# EAGLE design Rev A (EAGLE 6.5.0)

## Sheet 1 of 3: Pre-Amp
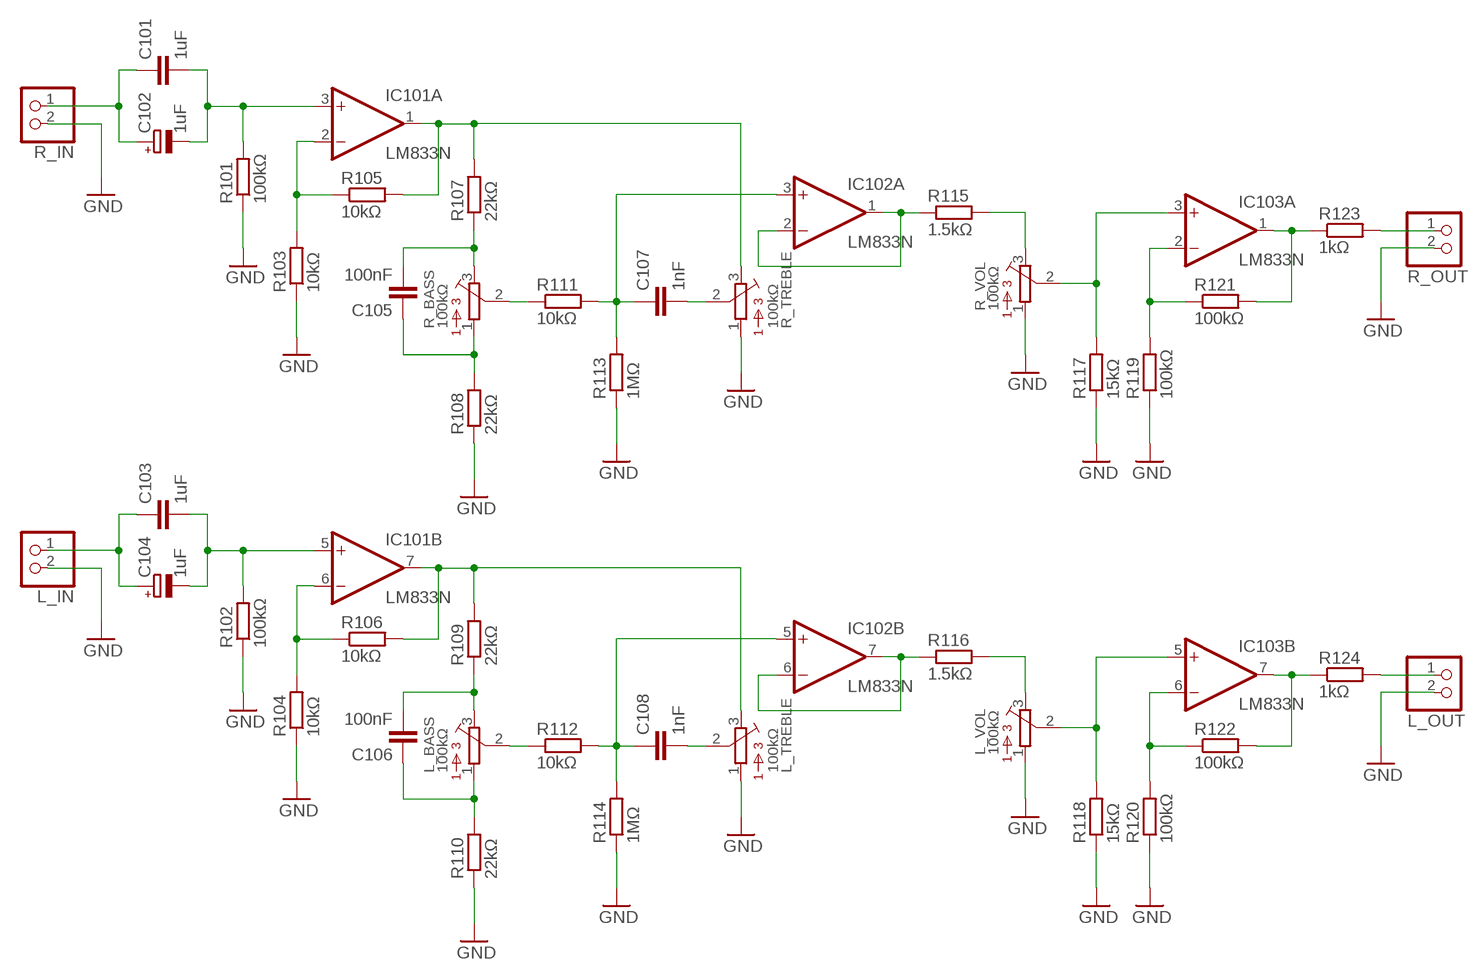
[diagram p0: schematic, sheet 1]

### Parts
C101  1uF  C-EU150-072X183  [C150-072X183]
C102  1uF  CPOL-EUE2-5  [E2-5]
C103  1uF  C-EU150-072X183  [C150-072X183]
C104  1uF  CPOL-EUE2-5  [E2-5]
C105  100nF  C-EU050-025X075  [C050-025X075]
C106  100nF  C-EU050-025X075  [C050-025X075]
C107  1nF  C-EU050-025X075  [C050-025X075]
C108  1nF  C-EU050-025X075  [C050-025X075]
IC101  LM833N  [DIL08]
IC102  LM833N  [DIL08]
IC103  LM833N  [DIL08]
L_BASS  100kΩ  3362U  [3362U]
L_IN  JST_2PIN-THM  [JST-PH-2-THM]
L_OUT  JST_2PIN-THM  [JST-PH-2-THM]
L_TREBLE  100kΩ  3362U  [3362U]
L_VOL  100kΩ  3362U  [3362U]
R101  100kΩ  R-EU_0207/10  [0207/10]
R102  100kΩ  R-EU_0207/10  [0207/10]
R103  10kΩ  R-EU_0207/10  [0207/10]
R104  10kΩ  R-EU_0207/10  [0207/10]
R105  10kΩ  R-EU_0207/10  [0207/10]
R106  10kΩ  R-EU_0207/10  [0207/10]
R107  22kΩ  R-EU_0207/10  [0207/10]
R108  22kΩ  R-EU_0207/10  [0207/10]
R109  22kΩ  R-EU_0207/10  [0207/10]
R110  22kΩ  R-EU_0207/10  [0207/10]
R111  10kΩ  R-EU_0207/10  [0207/10]
R112  10kΩ  R-EU_0207/10  [0207/10]
R113  1MΩ  R-EU_0207/10  [0207/10]
R114  1MΩ  R-EU_0207/10  [0207/10]
R115  1.5kΩ  R-EU_0207/10  [0207/10]
R116  1.5kΩ  R-EU_0207/10  [0207/10]
R117  15kΩ  R-EU_0207/10  [0207/10]
R118  15kΩ  R-EU_0207/10  [0207/10]
R119  100kΩ  R-EU_0207/10  [0207/10]
R120  100kΩ  R-EU_0207/10  [0207/10]
R121  100kΩ  R-EU_0207/10  [0207/10]
R122  100kΩ  R-EU_0207/10  [0207/10]
R123  1kΩ  R-EU_0207/10  [0207/10]
R124  1kΩ  R-EU_0207/10  [0207/10]
R_BASS  100kΩ  3362U  [3362U]
R_IN  JST_2PIN-THM  [JST-PH-2-THM]
R_OUT  JST_2PIN-THM  [JST-PH-2-THM]
R_TREBLE  100kΩ  3362U  [3362U]
R_VOL  100kΩ  3362U  [3362U]

### Nets
GND: L_IN.2 L_OUT.2 L_TREBLE.1 L_VOL.1 R101.1 R102.1 R103.1 R104.1 R108.1 R110.1 R113.1 R114.1 R117.1 R118.1 R119.1 R120.1 R_IN.2 R_OUT.2 R_TREBLE.1 R_VOL.1 ; also sheet 2,3
N$1: L_OUT.1 R124.2
N$2: R123.2 R_OUT.1
N$4: C101.2 C102.- IC101.3(A:+IN) R101.2
N$7: C103.2 C104.- IC101.5(B:+IN) R102.2
N$8: C101.1 C102.+ R_IN.1
N$22: C103.1 C104.+ L_IN.1
N$56: IC102.1(A:OUT) IC102.2(A:-IN) R115.1
N$57: C105.2 R107.1 R_BASS.3
N$58: IC103.3(A:+IN) R117.2 R_VOL.2
N$59: IC101.2(A:-IN) R103.2 R105.1
N$60: R115.2 R_VOL.3
N$61: C105.1 R108.2 R_BASS.1
N$62: IC103.2(A:-IN) R119.2 R121.1
N$63: IC103.1(A:OUT) R121.2 R123.1
N$64: R111.1 R_BASS.2
N$65: C107.1 IC102.3(A:+IN) R111.2 R113.2
N$66: C107.2 R_TREBLE.2
N$67: IC102.6(B:-IN) IC102.7(B:OUT) R116.1
N$68: IC101.6(B:-IN) R104.2 R106.1
N$69: IC101.1(A:OUT) R105.2 R107.2 R_TREBLE.3
N$70: IC103.5(B:+IN) L_VOL.2 R118.2
N$71: L_VOL.3 R116.2
N$72: C106.2 L_BASS.3 R109.1
N$73: C106.1 L_BASS.1 R110.2
N$74: L_BASS.2 R112.1
N$75: C108.1 IC102.5(B:+IN) R112.2 R114.2
N$76: C108.2 L_TREBLE.2
N$77: IC101.7(B:OUT) L_TREBLE.3 R106.2 R109.2
N$78: IC103.6(B:-IN) R120.2 R122.1
N$79: IC103.7(B:OUT) R122.2 R124.1

## Sheet 2 of 3: Power Supply
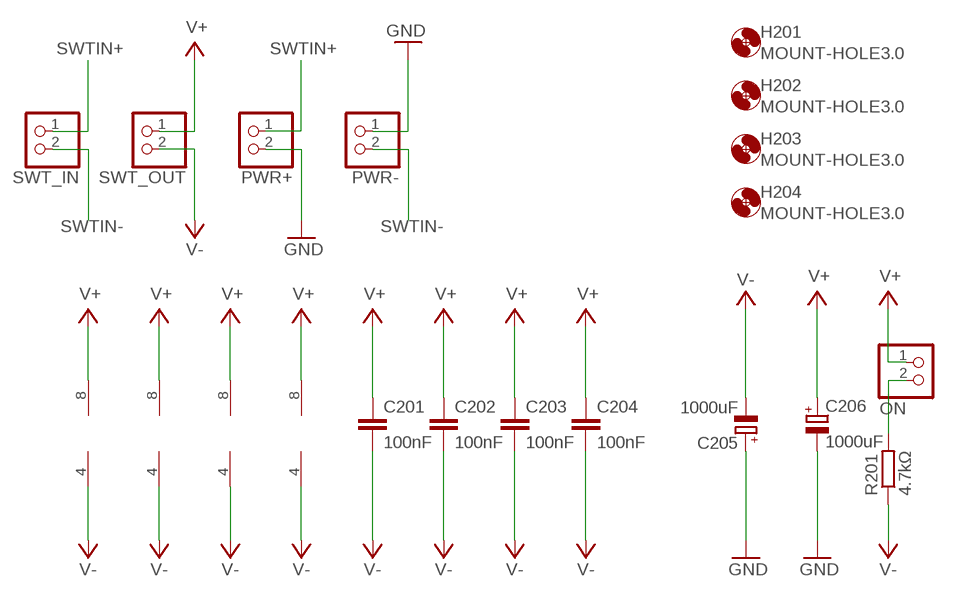
[diagram p1: schematic, sheet 2]

### Parts
C201  100nF  C-EU025-025X050  [C025-025X050]
C202  100nF  C-EU025-025X050  [C025-025X050]
C203  100nF  C-EU025-025X050  [C025-025X050]
C204  100nF  C-EU025-025X050  [C025-025X050]
C205  1000uF  CPOL-EUE5-10.5  [E5-10,5]
C206  1000uF  CPOL-EUE5-10.5  [E5-10,5]
H201  MOUNT-HOLE3.0  [3,0]
H202  MOUNT-HOLE3.0  [3,0]
H203  MOUNT-HOLE3.0  [3,0]
H204  MOUNT-HOLE3.0  [3,0]
IC201  LM393N  [DIL08]
ON  JST_2PIN-THM  [JST-PH-2-THM]
PWR+  JST_2PIN-THM  [JST-PH-2-THM]
PWR-  JST_2PIN-THM  [JST-PH-2-THM]
R201  4.7kΩ  R-EU_0207/10  [0207/10]
SWT_IN  JST_2PIN-THM  [JST-PH-2-THM]
SWT_OUT  JST_2PIN-THM  [JST-PH-2-THM]

### Nets
GND: C205.+ C206.- PWR+.2 PWR-.1 ; also sheet 1,3
N$55: ON.2 R201.2
SWTIN+: PWR+.1 SWT_IN.1
SWTIN-: PWR-.2 SWT_IN.2
V+: C201.1 C202.1 C203.1 C204.1 C206.+ IC101.8(P:V+) IC102.8(P:V+) IC103.8(P:V+) IC201.8(P:V+) ON.1 SWT_OUT.1 ; also sheet 3
V-: C201.2 C202.2 C203.2 C204.2 C205.- IC101.4(P:V-) IC102.4(P:V-) IC103.4(P:V-) IC201.4(P:V-) R201.1 SWT_OUT.2 ; also sheet 3

## Sheet 3 of 3: Low Voltage Detector
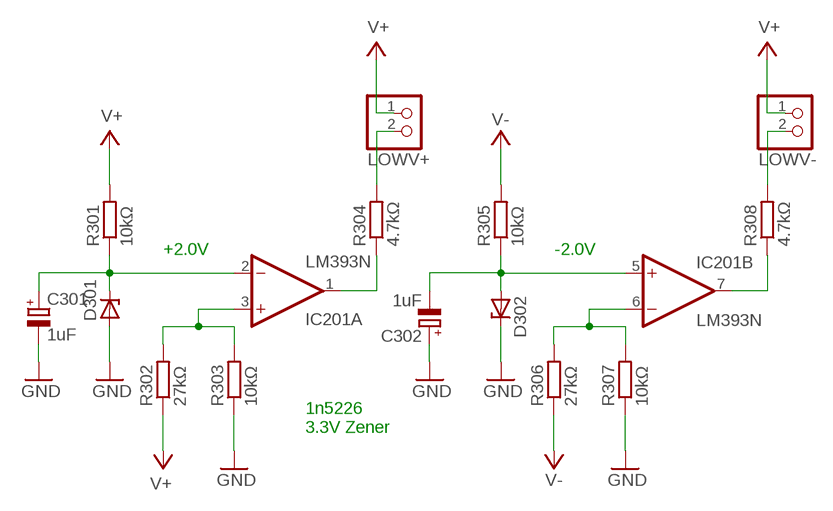
[diagram p2: schematic, sheet 3]

### Parts
C301  1uF  CPOL-EUE2-5  [E2-5]
C302  1uF  CPOL-EUE2-5  [E2-5]
D301  BZV10  [DO34Z7]
D302  BZV10  [DO34Z7]
LOWV+  JST_2PIN-THM  [JST-PH-2-THM]
LOWV-  JST_2PIN-THM  [JST-PH-2-THM]
R301  10kΩ  R-EU_0207/10  [0207/10]
R302  27kΩ  R-EU_0207/10  [0207/10]
R303  10kΩ  R-EU_0207/10  [0207/10]
R304  4.7kΩ  R-EU_0207/10  [0207/10]
R305  10kΩ  R-EU_0207/10  [0207/10]
R306  27kΩ  R-EU_0207/10  [0207/10]
R307  10kΩ  R-EU_0207/10  [0207/10]
R308  4.7kΩ  R-EU_0207/10  [0207/10]

### Nets
GND: C301.- C302.+ D301.A D302.C R303.1 R307.1 ; also sheet 1,2
N$3: C301.+ D301.C IC201.2(A:-IN) R301.1
N$5: C302.- D302.A IC201.5(B:+IN) R305.1
N$6: LOWV+.2 R304.2
N$9: IC201.3(A:+IN) R302.2 R303.2
N$10: IC201.6(B:-IN) R306.2 R307.2
N$11: IC201.1(A:OUT) R304.1
N$12: LOWV-.2 R308.2
N$13: IC201.7(B:OUT) R308.1
V+: LOWV+.1 LOWV-.1 R301.2 R302.1 ; also sheet 2
V-: R305.2 R306.1 ; also sheet 2

### Notes on the sheet
- +2.0V | -2.0V
- 1n5226
  3.3V Zener

## Library data of the parts
C101 C103 C105-C108 C201-C204 = rcl:C-EU: CAPACITOR, European symbol
C102 C104 C205 C206 C301 C302 = rcl:CPOL-EU: POLARIZED CAPACITOR, European symbol
D301 D302 = diode:BZV10: Z DIODE
H201-H204 = holes:MOUNT-HOLE: MOUNTING HOLE with drill center marker
IC101-IC103 = linear:LM833: OP AMP
IC201 = linear:LM393: COMPARATOR
L_BASS L_TREBLE L_VOL R_BASS R_TREBLE R_VOL = bourns:3362: 3362 Series 1/4" Square Trimmer
L_IN L_OUT LOWV+ LOWV- ON PWR+ PWR- R_IN R_OUT SWT_IN SWT_OUT = adafruit:JST_2PIN: JST 2-Pin Connectors of various flavors SMT-RA (S2B-PH-SM4) 4UConnector #17311 SMT (B2B-PH-SM4) THM-RA (S2B-PH) THM (B2B-PH)
R101-R124 R201 R301-R308 = rcl:R-EU_: RESISTOR, European symbol

## Board
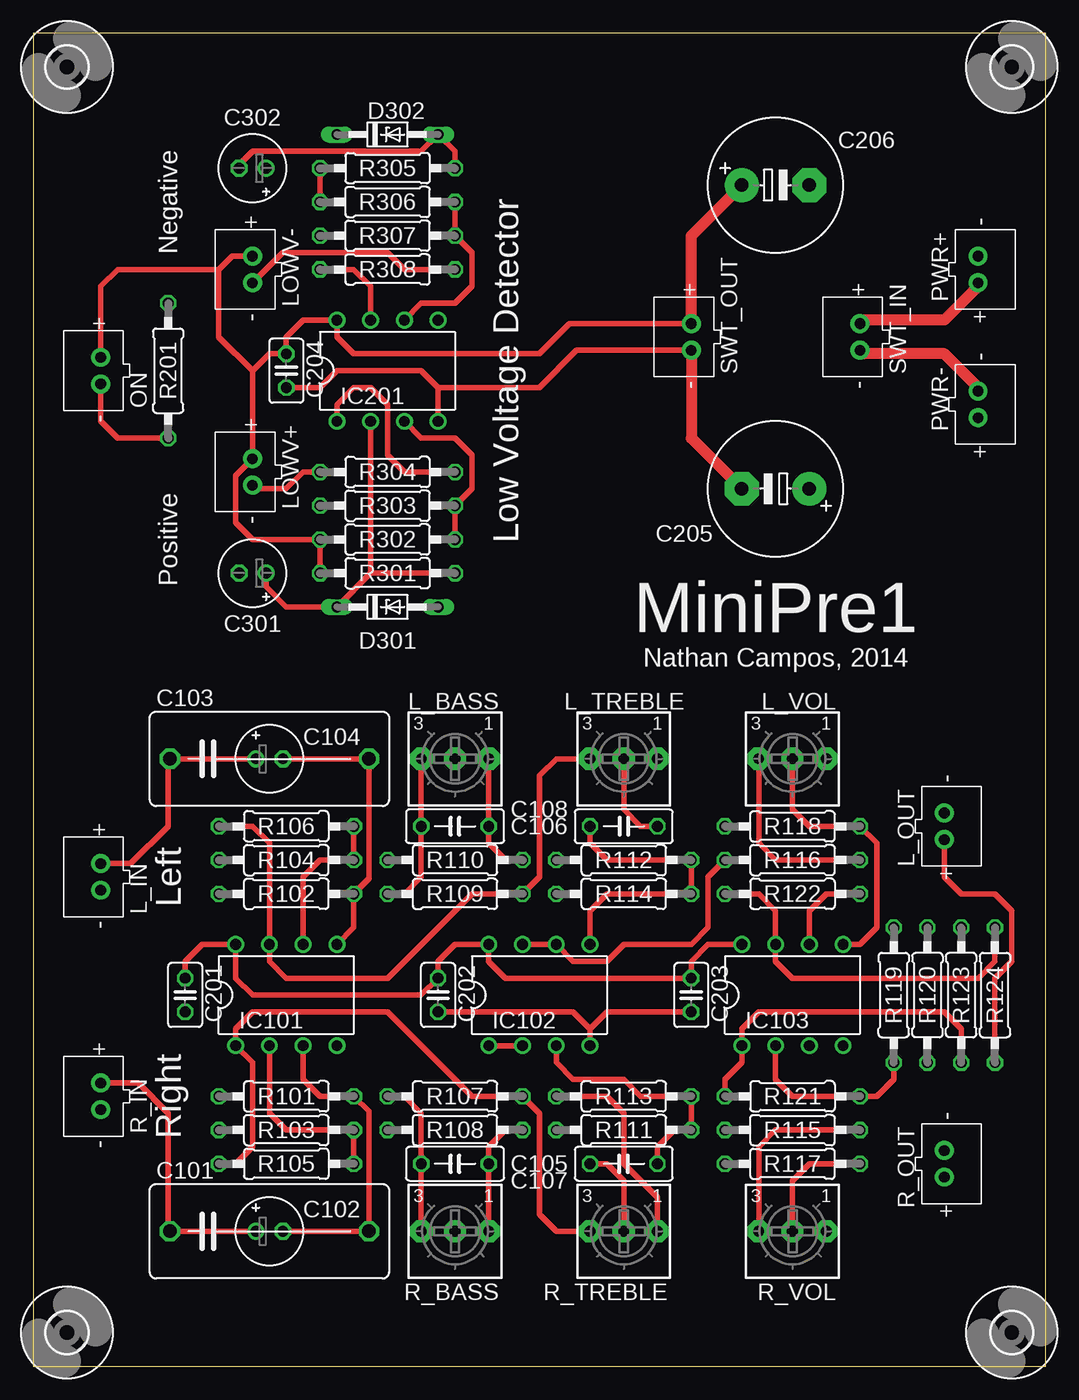
[diagram p3: board, top side]
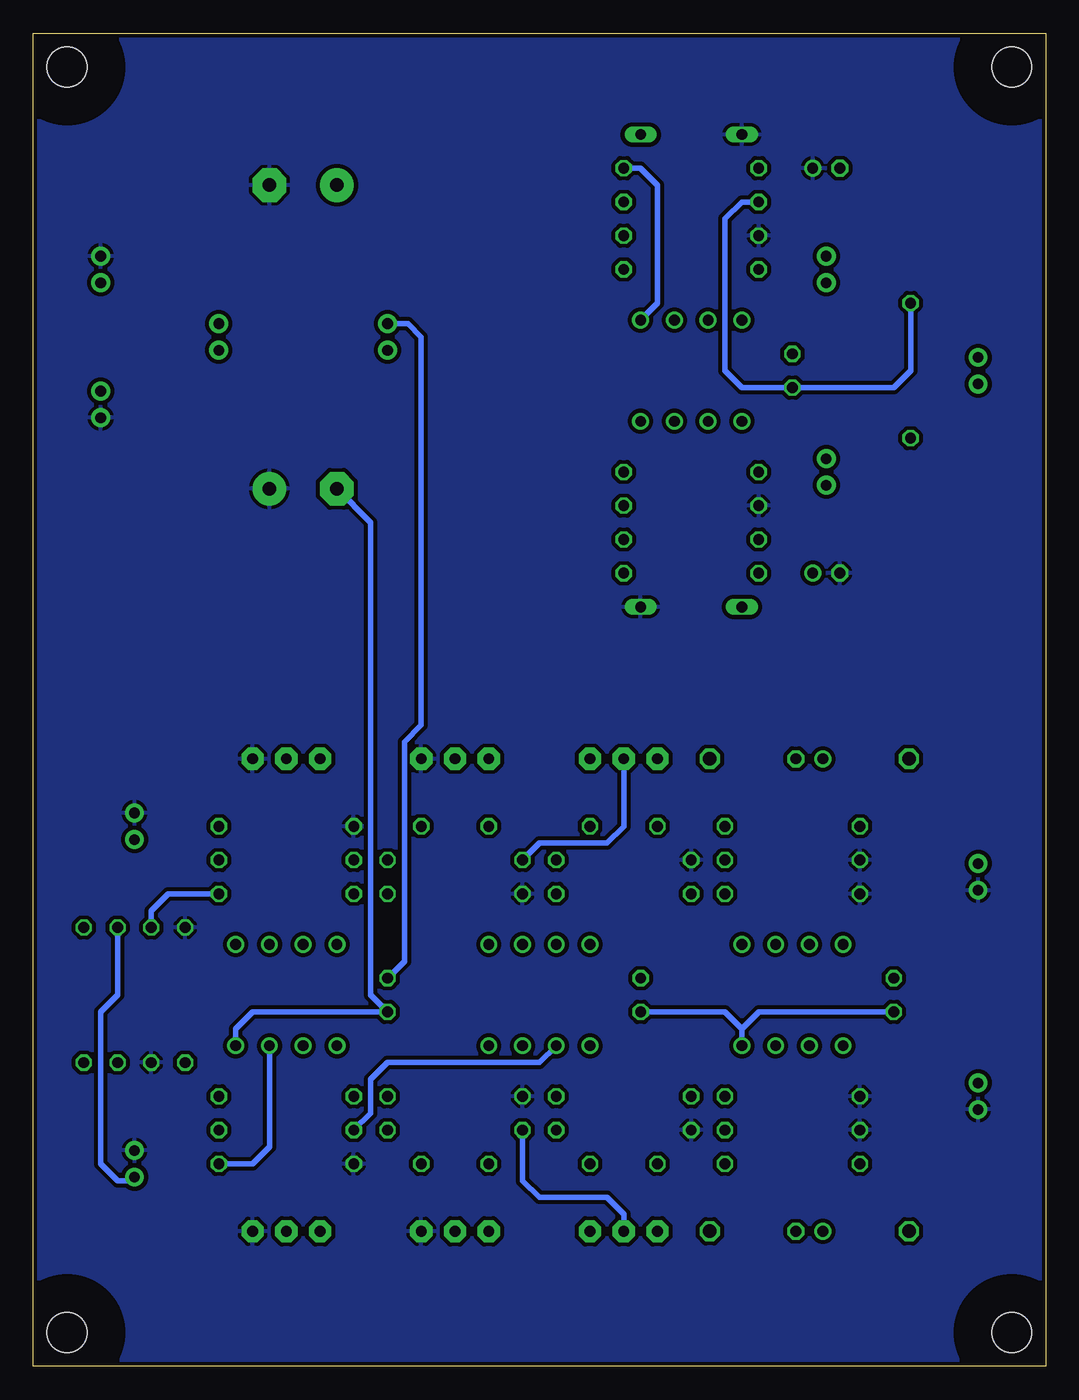
[diagram p4: board, bottom side, seen from below]

Size 76.2 x 100.33 mm. Coordinates in mm from the lower left corner, seen from the top.
Outline: 0,0 76.2,0 76.2,100.33 0,100.33 0,0
Copper layers (1*2*15*16): Top 0.035mm / dielectric 0.2mm / Route2 0.0175mm / dielectric 1.1mm / Route15 0.0175mm / dielectric 0.2mm / Bottom 0.035mm
Design rules "SeeedStudio_DRU_no_angle_20130527": minimum track width 6mil, minimum drill 12mil, track to track 6mil, track to pad 6mil, pad to pad 6mil, via to via 6mil, smd to smd 0mil, copper to edge 10mil, drill to drill 10mil, minimum pad ring 6mil, minimum via ring 6mil, stop-mask expansion 2mil, vias tented up to drill 25mil, thermal gap 10mil

### Footprints (pad centres in the part's own frame; a part is rotated, then mirrored left to right if it is on the bottom)
C150-072X183 = drill 1.016 octagon: 1 -7.493,0; 2 7.493,0
E2-5 = drill 0.813 pad 1.27: + -1.016,0 | drill 0.813 pad 1.27 octagon: - 1.016,0
C050-025X075 = drill 0.813 octagon: 1 -2.54,0; 2 2.54,0
C025-025X050 = drill 0.813 octagon: 1 -1.27,0; 2 1.27,0
E5-10,5 = drill 1.016 pad 2.54: + -2.54,0 | drill 1.016 pad 2.54 octagon: - 2.54,0
DO34Z7 = drill 0.813 long: A 3.81,0; C -3.81,0
3,0 = hole 3: 0,0
DIL08 = drill 0.813 pad 1.27: 1 -3.81,-3.81; 2 -1.27,-3.81; 3 1.27,-3.81; 4 3.81,-3.81; 5 3.81,3.81; 6 1.27,3.81; 7 -1.27,3.81; 8 -3.81,3.81
3362U = drill 0.813 pad 1.676 octagon: 1 -2.54,0; 2 0,0; 3 2.54,0
JST-PH-2-THM = drill 0.8 pad 1.422: 1 1,0; 2 -1,0
0207/10 = drill 0.813 octagon: 1 -5.08,0; 2 5.08,0

### Placement (x,y rotation side)
C101  17.78,10.16 0 top
C102  17.78,10.16 0 top
C103  17.78,45.72 0 top
C104  17.78,45.72 0 top
C105  31.75,15.24 180 top
C106  31.75,40.64 180 top
C107  44.45,15.24 180 top
C108  44.45,40.64 0 top
C201  11.43,27.94 270 top
C202  30.48,27.94 270 top
C203  49.53,27.94 270 top
C204  19.05,74.93 270 top
C205  55.88,66.04 180 top
C206  55.88,88.9 0 top
C301  16.51,59.69 180 top
C302  16.51,90.17 180 top
D301  26.67,57.15 0 top
D302  26.67,92.71 0 top
H201  2.54,2.54 0 top
H202  73.66,2.54 0 top
H203  73.66,97.79 0 top
H204  2.54,97.79 0 top
IC101  19.05,27.94 0 top
IC102  38.1,27.94 0 top
IC103  57.15,27.94 0 top
IC201  26.67,74.93 0 top
L_BASS  31.75,45.72 180 top
L_IN  5.08,36.83 90 top
L_OUT  68.58,40.64 270 top
L_TREBLE  44.45,45.72 180 top
L_VOL  57.15,45.72 180 top
LOWV+  16.51,67.31 90 top
LOWV-  16.51,82.55 90 top
ON  5.08,74.93 90 top
PWR+  71.12,82.55 270 top
PWR-  71.12,72.39 270 top
R101  19.05,20.32 0 top
R102  19.05,35.56 0 top
R103  19.05,17.78 0 top
R104  19.05,38.1 0 top
R105  19.05,15.24 180 top
R106  19.05,40.64 180 top
R107  31.75,20.32 0 top
R108  31.75,17.78 0 top
R109  31.75,35.56 0 top
R110  31.75,38.1 0 top
R111  44.45,17.78 0 top
R112  44.45,38.1 0 top
R113  44.45,20.32 0 top
R114  44.45,35.56 0 top
R115  57.15,17.78 0 top
R116  57.15,38.1 0 top
R117  57.15,15.24 0 top
R118  57.15,40.64 0 top
R119  64.77,27.94 270 top
R120  67.31,27.94 90 top
R121  57.15,20.32 180 top
R122  57.15,35.56 180 top
R123  69.85,27.94 90 top
R124  72.39,27.94 270 top
R201  10.16,74.93 270 top
R301  26.67,59.69 180 top
R302  26.67,62.23 0 top
R303  26.67,64.77 0 top
R304  26.67,67.31 180 top
R305  26.67,90.17 180 top
R306  26.67,87.63 0 top
R307  26.67,85.09 0 top
R308  26.67,82.55 0 top
R_BASS  31.75,10.16 180 top
R_IN  5.08,20.32 90 top
R_OUT  68.58,15.24 270 top
R_TREBLE  44.45,10.16 180 top
R_VOL  57.15,10.16 180 top
SWT_IN  62.23,77.47 90 top
SWT_OUT  49.53,77.47 90 top

### Tracks (layer width: path | path; a pad name or v marks a point on that pad's centre or on a via)
GND
  Top 0.406: R_TREBLE.1 46.99,12.7 44.45,15.24 44.45,19.05 43.18,20.32 R113.1
  pour Bottom (isolate 0.305): 0,100.33 76.2,100.33 76.2,0 0,0
N$1
  Top 0.406: R124.2 72.39,29.21 73.66,30.48 73.66,34.29 72.39,35.56 69.85,35.56 68.58,36.83 L_OUT.1
N$2
  Bottom 0.406: R123.2 69.85,27.94 71.12,26.67 71.12,15.24 69.85,13.97 68.85,13.97 R_OUT.1
N$3
  Top 0.406: IC201.2 25.4,59.69 | 25.4,59.69 D301.C 19.05,57.15 17.53,58.67 C301.+ | R301.1 25.4,59.69
N$4
  Top 0.406: C102.- C101.2 25.27,19.18 R101.2 21.59,20.32 20.32,21.59 IC101.3
N$5
  Top 0.406: R305.1 31.75,91.44 D302.A 29.21,91.44 16.51,91.44 15.49,90.42 C302.-
  Bottom 0.406: R305.1 30.48,90.17 29.21,88.9 29.21,80.01 IC201.5
N$6
  Top 0.406: R304.2 20.32,67.31 19.05,66.04 16.78,66.04 LOWV+.2
N$7
  Top 0.406: IC101.5 24.13,33.02 R102.2 25.27,36.7 C103.2 C104.-
N$8
  Top 0.406: C102.+ C101.1 10.16,10.29 10.16,19.05 7.89,21.32 R_IN.1
N$9
  Top 0.406: IC201.3 29.21,69.85 31.75,69.85 33.02,68.58 33.02,66.04 R303.2 R302.2
N$10
  Top 0.406: IC201.6 29.21,80.01 31.75,80.01 33.02,81.28 33.02,83.82 R307.2 R306.2
N$11
  Top 0.406: R304.1 27.94,67.31 26.67,68.58 26.67,72.39 25.4,73.66 24.13,73.66 22.86,72.39 IC201.1
N$12
  Top 0.406: R308.2 27.94,82.55 26.67,83.82 18.78,83.82 LOWV-.2
N$13
  Top 0.406: R308.1 24.13,82.55 25.4,81.28 IC201.7
N$22
  Top 0.406: C104.+ C103.1 10.16,45.59 10.16,40.64 7.35,37.83 L_IN.1
N$55
  Top 0.406: ON.2 5.08,71.12 6.35,69.85 R201.2
N$56
  Top 0.406: IC102.1 IC102.2
  Bottom 0.406: IC102.2 38.1,22.86 49.53,22.86 50.8,21.59 50.8,19.05 R115.1
N$57
  Top 0.406: R_BASS.3 C105.2 29.21,19.05 27.94,20.32 R107.1
N$58
  Top 0.406: R_VOL.2 57.15,13.97 58.42,15.24 R117.2
  Bottom 0.406: IC103.3 58.42,16.51 59.69,15.24 R117.2
N$59
  Top 0.406: IC101.2 17.78,19.05 19.05,17.78 R103.2 R105.1
N$60
  Top 0.406: R115.2 55.88,17.78 54.61,16.51 R_VOL.3
N$61
  Top 0.406: R_BASS.1 C105.1 34.29,16.51 35.56,17.78 R108.2
N$62
  Top 0.406: IC103.2 55.88,21.59 57.15,20.32 R121.1 63.5,20.32 64.77,21.59 R119.2
N$63
  Top 0.406: R121.2 52.07,21.59 53.34,22.86 IC103.1 53.34,25.4 54.61,26.67 68.58,26.67 69.85,25.4 R123.1
N$64
  Bottom 0.406: R111.1 39.37,13.97 38.1,12.7 33.02,12.7 31.75,11.43 R_BASS.2
N$65
  Top 0.406: IC102.3 39.37,22.86 40.64,21.59 44.45,21.59 45.72,20.32 R113.2 R111.2 48.26,17.78 46.99,16.51 C107.1
N$66
  Top 0.406: C107.2 43.18,15.24 44.45,13.97 R_TREBLE.2
N$67
  Top 0.406: IC102.7 IC102.6 40.64,30.48 43.18,30.48 44.45,31.75 49.53,31.75 50.8,33.02 50.8,36.83 R116.1
N$68
  Top 0.406: IC101.6 20.32,36.83 21.59,38.1 R104.2 R106.1
N$69
  Top 0.406: R105.2 15.24,15.24 16.51,16.51 16.51,22.86 IC101.1 15.24,25.4 16.51,26.67 26.67,26.67 33.02,20.32 R107.2 38.1,19.05 38.1,11.43 39.37,10.16 R_TREBLE.3
N$70
  Top 0.406: IC103.5 62.23,31.75 63.5,33.02 63.5,39.37 R118.2 58.42,40.64 57.15,41.91 L_VOL.2
N$71
  Top 0.406: R116.2 55.88,38.1 54.61,39.37 L_VOL.3
N$72
  Top 0.406: R109.1 27.94,35.56 29.21,36.83 C106.2 L_BASS.3
N$73
  Top 0.406: R110.2 35.56,38.1 34.29,39.37 C106.1 L_BASS.1
N$74
  Bottom 0.406: L_BASS.2 31.75,40.64 33.02,39.37 38.1,39.37 R112.1
N$75
  Top 0.406: IC102.5 41.91,34.29 43.18,35.56 R114.2 R112.2 43.18,38.1 41.91,39.37 C108.1
N$76
  Top 0.406: C108.2 45.72,40.64 44.45,41.91 L_TREBLE.2
N$77
  Top 0.406: R106.2 16.51,40.64 17.78,39.37 IC101.7 17.78,30.48 19.05,29.21 26.67,29.21 33.02,35.56 R109.2 38.1,36.83 38.1,44.45 39.37,45.72 L_TREBLE.3
N$78
  Top 0.406: R122.1 59.69,35.56 58.42,34.29 IC103.6
  Bottom 0.406: R122.1 66.04,35.56 67.31,34.29 R120.2
N$79
  Top 0.406: R122.2 54.61,35.56 55.88,34.29 IC103.7 55.88,30.48 57.15,29.21 71.12,29.21 72.39,30.48 R124.1
SWTIN+
  Top 0.813: PWR+.1 71.12,81.28 68.58,78.74 62.5,78.74 SWT_IN.1
SWTIN-
  Top 0.813: PWR-.2 71.12,73.66 68.58,76.2 62.5,76.2 SWT_IN.2
V+
  Top 0.406: C201.1 11.43,30.48 12.7,31.75 IC101.8 15.24,29.21 16.51,27.94 29.21,27.94 C202.1 30.48,30.48 31.75,31.75 IC102.8 34.29,30.48 35.56,29.21 C203.1 49.53,30.48 50.8,31.75 IC103.8 | R301.2 R302.1 16.51,62.23 15.24,63.5 15.24,67.04 LOWV+.1 16.51,74.93 | 16.51,74.93 17.78,76.2 C204.1 19.05,77.47 20.32,78.74 IC201.8 22.86,77.47 24.13,76.2 38.1,76.2 40.37,78.47 SWT_OUT.1 | LOWV-.1 14.97,83.55 13.97,82.55 | 13.97,82.55 13.97,77.47 16.51,74.93 | 13.97,82.55 6.35,82.55 5.08,81.28 ON.1
  Top 0.813: SWT_OUT.1 49.53,85.09 C206.+
  Bottom 0.406: SWT_OUT.1 47.99,78.47 46.99,77.47 46.99,48.26 48.26,46.99 48.26,30.48 C203.1
V-
  Top 0.406: C202.2 40.64,26.67 41.91,25.4 | 41.91,25.4 IC102.4 | 41.91,25.4 43.18,26.67 C203.2 | R305.2 R306.1 | C204.2 21.59,73.66 22.86,74.93 29.21,74.93 30.48,73.66 | 30.48,73.66 IC201.4 | SWT_OUT.2 40.91,76.47 38.1,73.66 30.48,73.66
  Top 0.813: SWT_OUT.2 49.53,69.85 C205.-
  Bottom 0.406: C201.2 21.59,26.67 22.86,25.4 | IC101.4 22.86,25.4 | 22.86,25.4 24.13,26.67 C202.2 | IC103.4 60.96,25.4 59.69,26.67 C203.2 50.8,27.94 50.8,63.5 C205.- | R306.1 22.86,87.63 24.13,86.36 24.13,74.93 22.86,73.66 C204.2 11.43,73.66 10.16,74.93 R201.1

### Text on the board
tPlace: Negative | Low Voltage Detector | Positive | MiniPre1 | Nathan Campos, 2014 | Left | Right